# EAGLE design main (EAGLE 6.5.0)
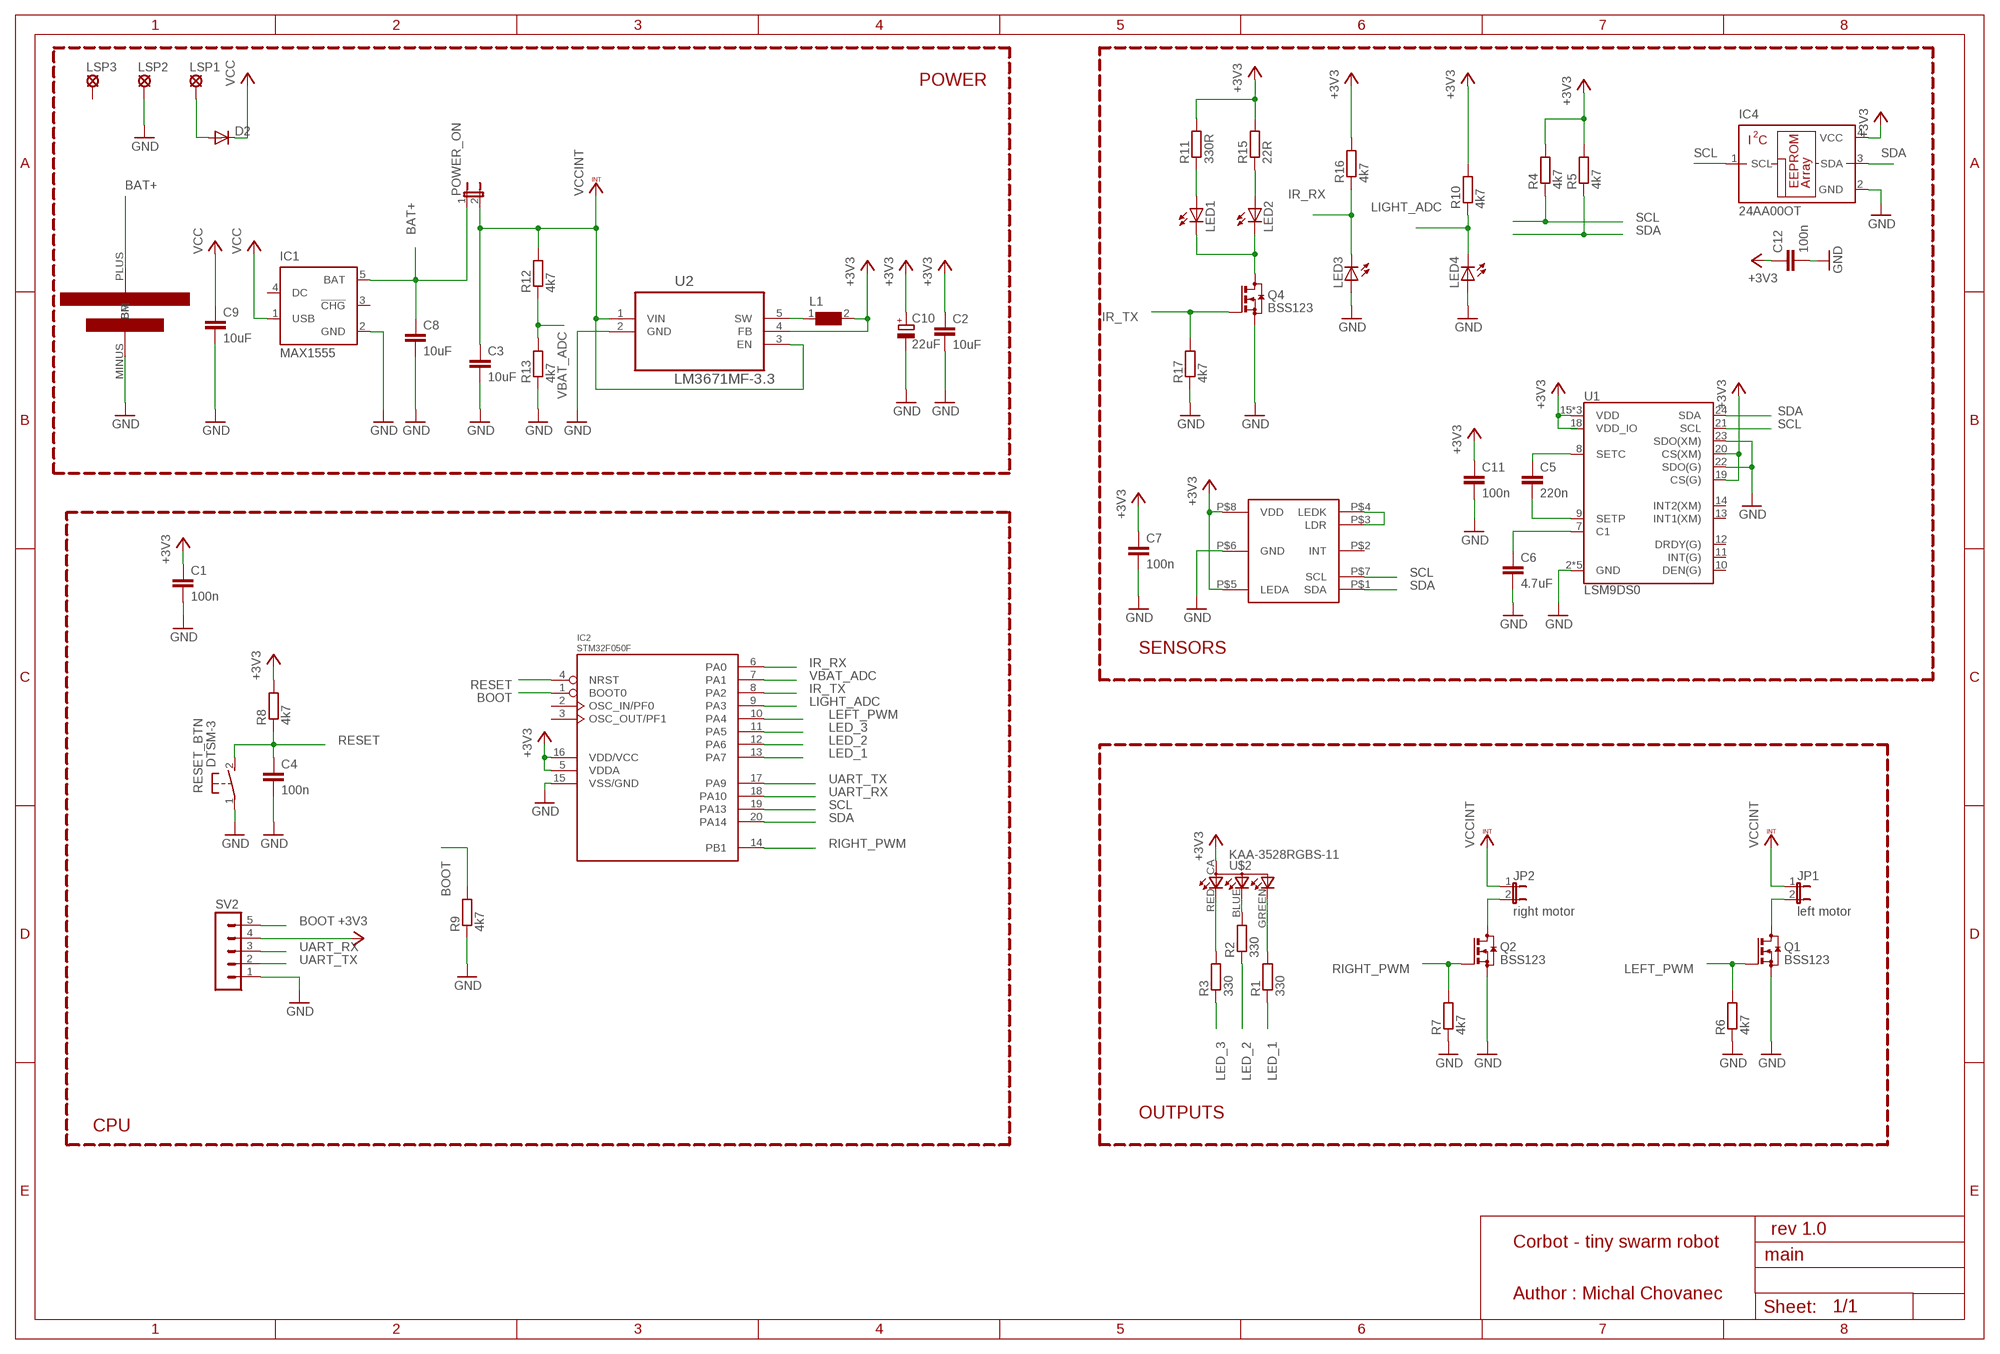
[diagram p0: schematic, sheet 1]

## Parts
C1  100n  C-EUC0805  [C0805]
C2  10uF  C-EUC0805  [C0805]
C3  10uF  C-EUC0805  [C0805]
C4  100n  C-EUC0805  [C0805]
C5  220n  C-EUC0805  [C0805]
C6  4.7uF  C-EUC0805  [C0805]
C7  100n  C-EUC0805  [C0805]
C8  10uF  C-EUC0805  [C0805]
C9  10uF  C-EUC0805  [C0805]
C10  22uF  CPOL-EU153CLV-0505  [153CLV-0505]
C11  100n  C-EUC0805  [C0805]
C12  100n  C-EUC0805  [C0805]
D2  DIODE-DO-214AC  [DO-214AC]
IC1  MAX1555  [SOT23-5L]
IC2  STM32F050F  [TSSOP20]
IC4  24AA00OT  [SOT23-5L]
JP1  left motor  JP1E  [JP1]
JP2  right motor  JP1E  [JP1]
L1  WE-LQ-744032002_M  [WE-LQ_M]
LED1  LEDCHIPLED_1206  [CHIPLED_1206]
LED2  LEDCHIPLED_1206  [CHIPLED_1206]
LED3  LEDCHIPLED_1206  [CHIPLED_1206]
LED4  LEDCHIPLED_1206  [CHIPLED_1206]
LSP1  LSP13  [LSP13]
LSP2  LSP13  [LSP13]
LSP3  LSP13  [LSP13]
POWER_ON  JP1E  [JP1]
Q1  BSS123  [SOT23]
Q2  BSS123  [SOT23]
Q4  BSS123  [SOT23]
R1  330  R-EU_M0805  [M0805]
R2  330  R-EU_M0805  [M0805]
R3  330  R-EU_M0805  [M0805]
R4  4k7  R-EU_M0805  [M0805]
R5  4k7  R-EU_M0805  [M0805]
R6  4k7  R-EU_M0805  [M0805]
R7  4k7  R-EU_M0805  [M0805]
R8  4k7  R-EU_M0805  [M0805]
R9  4k7  R-EU_M0805  [M0805]
R10  4k7  R-EU_M0805  [M0805]
R11  330R  R-EU_M0805  [M0805]
R12  4k7  R-EU_M0805  [M0805]
R13  4k7  R-EU_M0805  [M0805]
R15  22R  R-EU_M0805  [M0805]
R16  4k7  R-EU_M0805  [M0805]
R17  4k7  R-EU_M0805  [M0805]
RESET_BTN  DTSM-3  [DTSM-3]
SV2  MA05-1  [MA05-1]
U1  LSM9DS0  [LGA-24]
U2  LM3671MF-3.3  [SOT95P284X122-5N]
U$1  SMTU_2450N  [SMTU_2450N]
U$2  KAA-3528RGBS-11  [LED-RGB]
U$3  APDS9950  [APDS9950]

## Nets
+3V3: C1.1 C2.1 C7.1 C10.+ C11.1 C12.1 IC2.5(VDDA) IC2.16(VDD/VCC) IC4.4(VCC) L1.2 R4.2 R5.2 R8.2 R10.2 R11.2 R15.2 R16.2 SV2.4 U1.15(VDD) U1.16(VDD) U1.17(VDD) U1.19(CS(G)) U1.20(CS(XM)) U2.4(FB) U$2.CA(A) U$3.P$5(LEDA) U$3.P$8(VDD)
BAT+: C8.1 IC1.5(BAT) POWER_ON.1 U$1.PLUS(BP)
BOOT: IC2.1(BOOT0) R9.2 SV2.5
GND: C1.2 C2.2 C3.2 C4.2 C6.2 C7.2 C8.2 C9.2 C10.- C11.2 C12.2 IC1.2(GND) IC2.15(VSS/GND) IC4.2(GND) LED3.A LED4.A LSP2.MP Q1.2(S) Q2.2(S) Q4.2(S) R6.1 R7.1 R9.1 R13.1 R17.1 RESET_BTN.1 SV2.1 U1.2(GND) U1.3(GND) U1.4(GND) U1.5(GND) U1.6(GND) U1.22(SDO(G)) U1.23(SDO(XM)) U2.2(GND) U$1.MINUS(BM) U$3.P$6(GND)
IR_RX: IC2.6(PA0) LED3.C R16.1
IR_TX: IC2.8(PA2) Q4.1(G) R17.2
LED_1: IC2.13(PA7) R1.1
LED_2: IC2.12(PA6) R2.1
LED_3: IC2.11(PA5) R3.1
LEFT_PWM: IC2.10(PA4) Q1.1(G) R6.2
LIGHT_ADC: IC2.9(PA3) LED4.C R10.1
N$1: R3.2 U$2.RED(CRED)
N$2: R2.2 U$2.BLUE(CBLUE)
N$3: R1.2 U$2.GREEN(CGREEN)
N$4: U$3.P$3(LDR) U$3.P$4(LEDK)
N$5: C6.1 U1.7(C1)
N$6: LED1.C LED2.C Q4.3(D)
N$7: L1.1 U2.5(SW)
N$8: C5.1 U1.8(SETC)
N$9: D2.A LSP1.MP
N$10: LED2.A R15.1
N$11: C5.2 U1.9(SETP)
N$14: JP1.2 Q1.3(D)
N$15: JP2.2 Q2.3(D)
N$16: LED1.A R11.1
RESET: C4.1 IC2.4(NRST) R8.1 RESET_BTN.2
RIGHT_PWM: IC2.14(PB1) Q2.1(G) R7.2
SCL: IC2.19(PA13) IC4.1(SCL) R4.1 U1.21(SCL) U$3.P$7(SCL)
SDA: IC2.20(PA14) IC4.3(SDA) R5.1 U1.24(SDA) U$3.P$1(SDA)
UART_RX: IC2.18(PA10) SV2.3
UART_TX: IC2.17(PA9) SV2.2
VBAT_ADC: IC2.7(PA1) R12.1 R13.2
VCC: C9.1 D2.C IC1.1(USB)
VCCINT: C3.1 JP1.1 JP2.1 POWER_ON.2 R12.2 U2.1(VIN) U2.3(EN)
Unconnected: IC1.3(!CHG) IC1.4(DC) IC2.2(OSC_IN/PF0) IC2.3(OSC_OUT/PF1) LSP3.MP U1.10(DEN(G)) U1.11(INT(G)) U1.12(DRDY(G)) U1.13(INT1(XM)) U1.14(INT2(XM)) U1.18(VDD_IO) U$3.P$2(INT)

## Notes on the sheet
- POWER
- SENSORS
- OUTPUTS
- CPU
- rev 1.0
- Corbot - tiny swarm robot
- Author : Michal Chovanec

## Library data of the parts
C1-C9 C11 C12 = resistor:C-EU: CAPACITOR, European symbol
C10 = resistor:CPOL-EU: POLARIZED CAPACITOR, European symbol
D2 = diode:DIODE-: DIODE
IC1 = maxim:MAX1555: Dual-Input USB/AC Adapter 1-Cell Li+ Battery Chargers Source: http://www.maxim-ic.com .. MAX1551-MAX1555.pdf; MF: MAXIM; MPN: MAX1555EZK+T; OC_FARNELL: 1628222; OC_NEWARK: 59J2761
IC2 = STM32F050:STM32F050*: STM32F050xxF*
IC4 = microchip:24*00: Serial EEPROM 128 bit, I2C (AA = 1.8 V/LC = 2.5 V/C = 5.0 V); MF: MICROCHIP; MPN: 24AA00T-I/OTG; OC_FARNELL: 1331264; OC_NEWARK: 89H3038
JP1 JP2 POWER_ON = jumper:JP1E: JUMPER
L1 = WE-LQ:WE-LQ: SMD RF Inductor WE-LQ - High Q at high frequences - Low DC-resistance - Miniature chip inductor wound on a special ferrite core -- Low power DC/DC-converters from Linear Technology, National Semiconductor, Texas Instruments and Fairchild Semiconductor ect. -- Test & measurement equipment -- EMI-Filtering -- RF-circuit; MPN: 744032002; OC_FARNELL: 1800378; OC_NEWARK: 78R5670; PACKAGE: 1210; SUPPLIER: WURTH ELEKTRONIK
LED1-LED4 = led:LED: LED OSRAM: - CHIPLED LG R971, LG N971, LY N971, LG Q971, LY Q971, LO R971, LY R971 LH N974, LH R974 LS Q976, LO Q976, LY Q976 LO Q996 - Hyper CHIPLED LW Q18S LB Q993, LB Q99A, LB R99A - SideLED LS A670, LO A670, LY A670, LG A670, LP A670 LB A673, LV A673, LT A673, LW A673 LH A674 LY A675 LS A676, LA A676, LO A676, LY A676, LW A676 LS A679, LY A679, LG A679 - Hyper Micro SIDELED® LS Y876, LA Y876, LO Y876, LY Y876 LT Y87S - SmartLED LW L88C, LW L88S LB L89C, LB L89S, LG L890 LS L89K, LO L89K, LY L89K LS L896, LA L896, LO L896, LY L896 - TOPLED LS T670, LO T670, LY T670, LG T670, LP T670 LSG T670, LSP T670, LSY T670, LOP T670, LYG T670 LG T671, LOG T671, LSG T671 LB T673, LV T673, LT T673, LW T673 LH T674 LS T676, LA T676, LO T676, LY T676, LB T676, LH T676, LSB T676, LW T676 LB T67C, LV T67C, LT T67C, LS T67K, LO T67K, LY T67K, LW E67C LS E67B, LA E67B, LO E67B, LY E67B, LB E67C, LV E67C, LT E67C LW T67C LS T679, LY T679, LG T679 LS T770, LO T770, LY T770, LG T770, LP T770 LB T773, LV T773, LT T773, LW T773 LH T774 LS E675, LA E675, LY E675, LS T675 LS T776, LA T776, LO T776, LY T776, LB T776 LHGB T686 LT T68C, LB T68C - Hyper Mini TOPLED® LB M676 - Mini TOPLED Santana® LG M470 LS M47K, LO M47K, LY M47K Source: http://www.osram.convergy.de LUXEON: - LUMILED® LXK2-PW12-R00, LXK2-PW12-S00, LXK2-PW14-U00, LXK2-PW14-V00 LXK2-PM12-R00, LXK2-PM12-S00, LXK2-PM14-U00 LXK2-PE12-Q00, LXK2-PE12-R00, LXK2-PE12-S00, LXK2-PE14-T00, LXK2-PE14-U00 LXK2-PB12-K00, LXK2-PB12-L00, LXK2-PB12-M00, LXK2-PB14-N00, LXK2-PB14-P00, LXK2-PB14-Q00 LXK2-PR12-L00, LXK2-PR12-M00, LXK2-PR14-Q00, LXK2-PR14-R00 LXK2-PD12-Q00, LXK2-PD12-R00, LXK2-PD12-S00 LXK2-PH12-R00, LXK2-PH12-S00 LXK2-PL12-P00, LXK2-PL12-Q00, LXK2-PL12-R00 Source: www.luxeon.com KINGBRIGHT: KA-3528ASYC Source: www.kingbright.com
LSP1-LSP3 = solpad:LSP13: SOLDER PAD drill 1.3 mm, distributor Buerklin, 12H562
Q1 Q2 Q4 = transistor-small-signal:BSS123: N-CHANNEL MOS FET
R1-R13 R15-R17 = resistor:R-EU_: RESISTOR, European symbol
RESET_BTN = switch-tact:DTSM-3
SV2 = con-lstb:MA05-1: PIN HEADER; OC_FARNELL: unknown; OC_NEWARK: unknown
U1 = main:LSM9DS0: LSM9DS0 3D Accelerometer, 3D Gyroscope, 3D Magnetomter Features: 3 acceleration channels, 3 angular rate channels, 3 magnetic field channels ±2/±4/±6/±8/±16 g linear acceleration full scale ±2/±4/±8/±12 gauss magnetic full scale ±245/±500/±2000 dps angular rate full scale 16-bit data output SPI / I2C serial interfaces Analog supply voltage 2.4 V to 3.6 V Power-down mode / low-power mode Programmable interrupt generators Embedded self-test Embedded temperature sensor Embedded FIFO Position and motion detection functions Click/double-click recognition
U2 = my_parts:LM3671MF-3.3: IC BUCK SYNC 3.3V 0.6A; MPN: LM3671MF-3.3; OC_FARNELL: 1685767; OC_NEWARK: 79K7838; PACKAGE: 5-SOT-23; SUPPLIER: NationalSemiconductor
U$1 = corbot:SMTU_2450N
U$2 = corbot:KAA-3528RGBS-11: Farnell ID : 2335789
U$3 = main:APDS9950

## Board
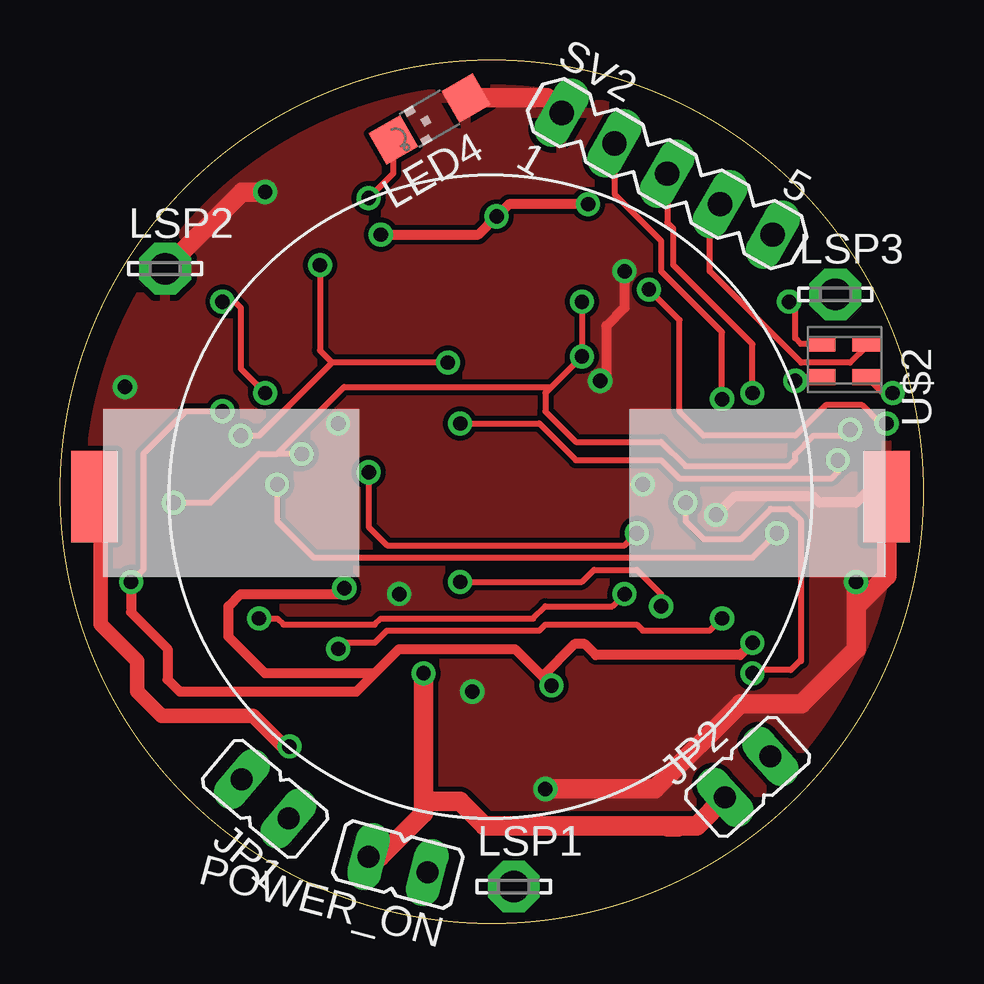
[diagram p1: board, top side]
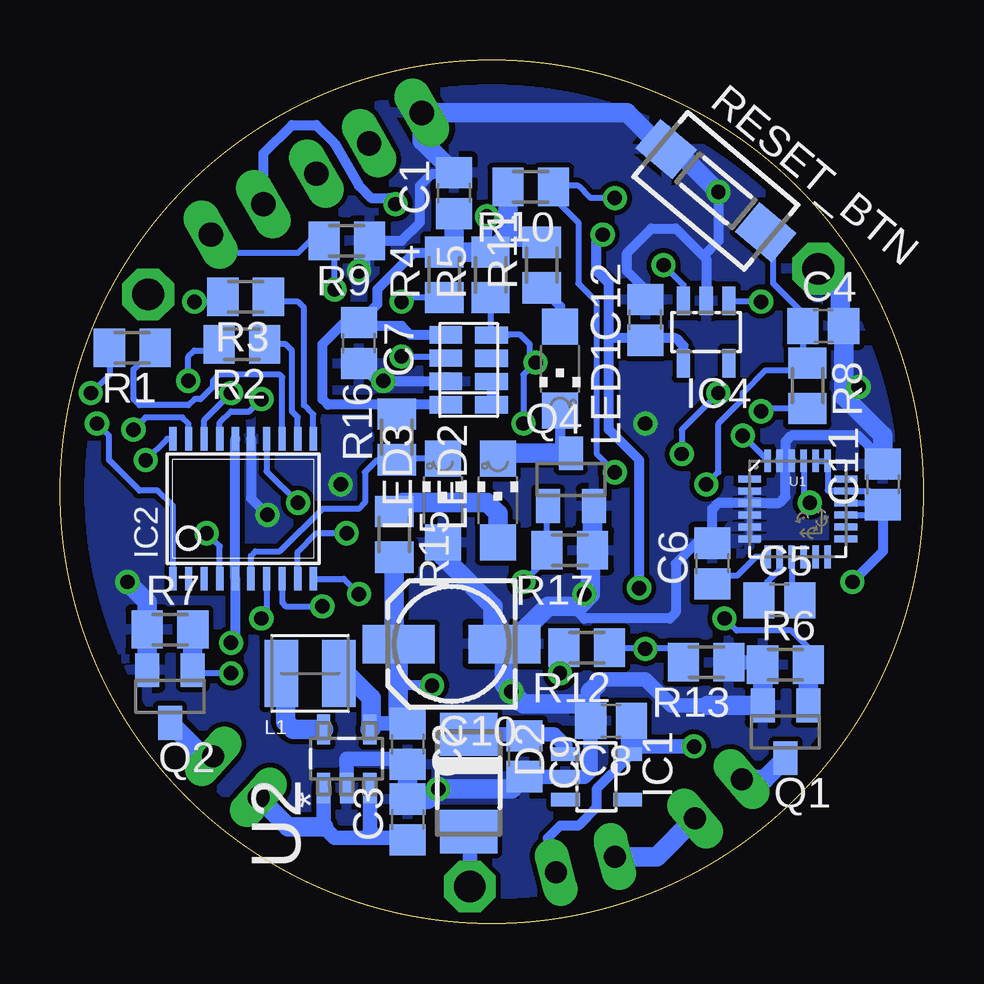
[diagram p2: board, bottom side, seen from below]

Size 36 x 36 mm. Coordinates in mm from the lower left corner, seen from the top.
Outline: circle at 18,18 radius 18
Copper layers (1*16): Top 0.035mm / dielectric 1.5mm / Bottom 0.035mm
Design rules "default": minimum track width 10mil, minimum drill 24mil, track to track 8mil, track to pad 8mil, pad to pad 8mil, via to via 8mil, smd to smd 8mil, copper to edge 40mil, drill to drill 8mil, minimum pad ring 10mil, minimum via ring 8mil, stop-mask expansion 4mil, vias tented up to drill 0mil, thermal gap 10mil

### Footprints (pad centres in the part's own frame; a part is rotated, then mirrored left to right if it is on the bottom)
C0805 = smd 1.3 x 1.5: 1 -0.85,0; 2 0.85,0
153CLV-0505 = smd 3 x 1.6: + 2.2,0; - -2.2,0
DO-214AC = smd 1.8 x 2.4: A 2.025,0; C -2.025,0
SOT23-5L = smd 0.55 x 1.2: 1 -0.95,-1.3; 2 0,-1.3; 3 0.95,-1.3; 4 0.95,1.3; 5 -0.95,1.3
TSSOP20 = smd 0.305 x 0.991: 1 -2.925,-2.918; 2 -2.275,-2.918; 3 -1.625,-2.918; 4 -0.975,-2.918; 5 -0.325,-2.918; 6 0.325,-2.918; 7 0.975,-2.918; 8 1.625,-2.918; 9 2.275,-2.918; 10 2.925,-2.918; 11 2.925,2.918; 12 2.275,2.918; 13 1.625,2.918; 14 0.975,2.918; 15 0.325,2.918; 16 -0.325,2.918; 17 -0.975,2.918; 18 -1.625,2.918; 19 -2.275,2.918; 20 -2.925,2.918
JP1 = drill 0.914 long: 1 0,-1.27; 2 0,1.27
WE-LQ_M = smd 1.4 x 2.8: 1 -1.2,0; 2 1.2,0
CHIPLED_1206 = smd 1.5 x 1.5: A 0,-1.75; C 0,1.75
LSP13 = drill 1.321 pad 2.159 octagon: MP 0,0
SOT23 = smd 1 x 1.4: 1 -0.95,-1.1; 2 0.95,-1.1; 3 0,1.1
M0805 = smd 1.3 x 1.6: 1 -0.95,0; 2 0.95,0
DTSM-3 = smd 2 x 1.6: 1 -2.7,0; 2 2.7,0
MA05-1 = drill 1.016 long: 1 -5.08,0; 2 -2.54,0; 3 0,0; 4 2.54,0; 5 5.08,0
LGA-24 = smd 0.954 x 0.29: 1 -2.002,1.25; 2 -2.002,0.75; 3 -2.002,0.25; 4 -2.002,-0.25; 5 -2.002,-0.75; 6 -2.002,-1.25; 13 2.002,-1.25; 14 2.002,-0.75; 15 2.002,-0.25; 16 2.002,0.25; 17 2.002,0.75; 18 2.002,1.25 | smd 0.29 x 0.954: 7 -1.25,-2.002; 8 -0.75,-2.002; 9 -0.25,-2.002; 10 0.25,-2.002; 11 0.75,-2.002; 12 1.25,-2.002; 19 1.25,2.002; 20 0.75,2.002; 21 0.25,2.002; 22 -0.25,2.002; 23 -0.75,2.002; 24 -1.25,2.002
SOT95P284X122-5N = smd 1.27 x 0.559: 1 -1.219,0.965; 2 -1.219,0; 3 -1.219,-0.965; 4 1.219,-0.965; 5 1.219,0.965
SMTU_2450N = smd 1.93 x 3.81: MINUS 16.51,0; PLUS -16.51,0
LED-RGB = smd 0.65 x 1.2: BLUE 2.634,0.827; CA 1.252,2.729; GREEN 2.634,2.729; RED 1.252,0.827
APDS9950 = smd 1.362 x 0.72: P$1 0.954,1.4; P$2 0.954,0.43; P$3 0.954,-0.54; P$4 0.954,-1.51; P$5 -0.954,-1.5; P$6 -0.954,-0.53; P$7 -0.954,0.44; P$8 -0.954,1.41

### Placement (x,y rotation side)
C1  19.57,30.45 90 bottom
C2  21.51,7.48 270 bottom
C3  21.51,4.33 90 bottom
C4  4.18,24.91 0 bottom
C5  6.01,13.48 0 bottom
C6  8.81,15 90 bottom
C7  23.54,24.2 270 bottom
C8  13.02,8.45 180 bottom
C9  16.63,6.98 270 bottom
C10  19.68,11.65 180 bottom
C11  1.69,18.3 90 bottom
C12  11.6,25.16 90 bottom
D2  18.97,5.86 270 bottom
IC1  13.63,6.11 270 bottom
IC2  28.36,17.29 0 bottom
IC4  9.06,24.65 180 bottom
JP1  8.55,5.2 50 top
JP2  28.67,6.11 312 top
L1  25.57,10.43 0 bottom
LED1  15.16,23.13 180 bottom
LED2  17.75,17.64 0 bottom
LED3  20.03,17.64 0 bottom
LED4  15.41,33.54 120 top
LSP1  18.91,1.54 0 top
LSP2  4.39,27.3 0 top
LSP3  32.33,26.23 0 top
POWER_ON  14.09,2.46 75 top
Q1  5.76,7.99 180 bottom
Q2  31.41,9.47 180 bottom
Q4  14.7,18.51 0 bottom
R1  32.99,23.99 180 bottom
R2  28.41,24.15 180 bottom
R3  28.26,26.13 180 bottom
R4  19.98,27.04 90 bottom
R5  18.05,27.04 90 bottom
R6  5.76,10.79 0 bottom
R7  31.41,12.26 0 bottom
R8  4.84,22.42 270 bottom
R9  24.05,28.46 180 bottom
R10  16.37,30.7 180 bottom
R11  15.92,27.45 90 bottom
R12  14.04,11.5 180 bottom
R13  9.06,10.89 180 bottom
R15  22.06,16.22 270 bottom
R16  21.96,20.29 90 bottom
R17  14.75,15.56 180 bottom
RESET_BTN  8.65,30.55 320 bottom
SV2  25.32,31.26 330 top
U1  5.25,17.29 0 bottom
U2  24.05,6.87 90 bottom
U$1  17.95,17.8 0 top
U$2  30.9,25.42 270 top
U$3  18.97,23.13 0 bottom

### Tracks (layer width: path | path; a pad name or v marks a point on that pad's centre or on a via)
+3V3  (via drill 0.6)
  Top 0.254: v6.77,21.35 5.25,21.35 3.47,19.57 3.47,14.75 v2.96,14.24 | U$2.CA 33.63,24.08 32.94,23.38 30.9,23.38 27.09,27.19 27.09,29.57 SV2.4
  Top 0.406: v2.96,14.24 2.96,12.97 4.49,11.45 4.49,10.18 5,9.67 12.36,9.67 13.12,10.43 | 20.11,10.3 18.97,11.45 14.14,11.45 13.12,10.43 | 20.11,10.3 v20.49,9.92 | v28.87,11.7 28.36,11.19 22.33,11.19 C10.+ 21.45,11.65 20.11,10.3 | v22.01,29.99 18.71,29.99 v18.2,29.48 17.44,28.72 v13.38,28.72 | 13.12,10.43 8.55,10.43 7.03,11.95 7.03,13.22 7.54,13.73 11.6,13.73 v11.85,13.99
  Bottom 0.254: 21.9,11.63 21.89,11.63 C10.+ | U1.16 1.78,17.54 C11.1 | C11.1 2.28,18.04 U1.17 3.26,18.05 3.98,18.05 4,18.07 U1.19 U1.20 | U1.15 2.11,17.04 C11.1 | R8.2 6.66,21.47 v6.77,21.35
  Bottom 0.406: C11.1 1.69,15.51 v2.96,14.24 | v20.49,9.92 21.64,9.92 21.9,10.18 | U$3.P$5 21.57,21.63 R16.2 | 15.85,28.46 R11.2 17.64,28.4 R5.2 18.2,28.14 v18.2,29.48 | 19.98,21.57 U$3.P$5 | U$3.P$5 24.83,21.63 25.06,21.86 25.06,24.15 24.16,25.05 C7.1 | 20.24,27.96 19.98,27.96 | R4.2 20.2,27.99 20.24,27.96 | v28.87,11.7 28.69,11.88 IC2.5 IC2.16 | U$3.P$8 21.39,24.54 21.76,24.91 23.4,24.91 C7.1 | 20.24,27.96 21.25,27.96 22.78,26.43 22.78,25.81 C7.1 | SV2.4 27.52,32.11 26.33,33.29 25.32,33.29 24.55,32.53 23.54,30.75 23.03,30.24 22.27,30.24 v22.01,29.99 | v11.85,13.99 11.85,19.32 13.12,20.59 13.12,24.4 | v13.38,28.72 13.63,28.46 13.63,27.19 13.12,26.69 13.12,24.4 | IC4.4 10.01,24.08 10.33,24.4 11.51,24.4 | 11.51,24.4 C12.1 | 11.51,24.4 13.12,24.4
  Bottom 0.61: 22.85,8.33 U2.4 22.84,8.33 C2.1
  Bottom 0.813: 21.9,11.63 21.9,10.18 21.9,8.72 C2.1 | L1.2 24.05,10.43 23.03,9.41 23.03,8.14 U2.4 | R15.2 22.06,11.84 C10.+ | R10.2 17.32,28.72 R5.2 19.47,27.99 | 19.47,27.99 R4.2 | C1.1 19.58,28.09 19.47,27.99
BAT+  (via drill 0.6)
  Top 0.61: v9.57,7.38 9.31,7.38 8.04,8.65 4.23,8.65 3.22,9.67 3.22,10.94 1.69,12.46 1.69,17.54 U$1.PLUS
  Bottom 0.406: IC1.5 12.33,6.9 13.63,5.6 13.63,4.84 14.39,4.08 15.16,4.08 15.66,3.57 15.66,2.47 POWER_ON.1
  Bottom 0.61: C8.1 12.33,8.29 IC1.5 12.01,7.38 v9.57,7.38
BOOT  (via drill 0.6)
  Top 0.254: v34.46,20.84 34.21,20.84 33.44,21.61 31.92,21.61 30.65,20.34 26.84,20.34 25.82,21.35 25.82,25.16 v24.55,26.43
  Bottom 0.254: SV2.5 28.95,27.96 26.08,27.96 25.13,28.91 R9.2 24.55,28.02 v24.55,26.43 | IC2.1 31.29,17.42 31.92,18.05 32.68,18.05 33.95,19.32 33.95,20.34 v34.46,20.84
GND  (via drill 0.6)
  Top 0.406: U$1.MINUS 34.21,18.05 33.7,18.05 33.19,17.54 31.67,17.54 31.41,17.8 28.11,17.8 v27.35,17.03 | v23.54,27.19 23.54,25.67 22.78,24.91 22.78,22.88 v22.52,22.62
  Top 0.813: v33.19,14.24 33.19,13.22 | 33.19,13.22 33.19,11.45 30.9,9.16 28.36,9.16 24.81,5.6 v20.24,5.6 | v8.55,30.5 7.59,30.5 LSP2.MP | LED4.A 20.3,34.42 SV2.1 | U$1.MINUS 34.46,14.49 33.19,13.22
  Bottom 0.254: U1.2 U1.3 U1.4 U1.5 U1.6 | 5.76,19.05 5.74,19.05 U1.22
  Bottom 0.406: U1.23 5.76,19.05 5.76,17.8 6.02,17.54 U1.3 | U1.3 8.55,17.54 8.81,17.29 C6.2 9.48,15.85 10.33,15 10.33,12.97 10.58,12.72 14.14,12.72 14.65,13.22 | 6.77,17.54 U1.3 | C11.2 1.69,19.32 2.71,20.34 5.5,20.34 5.76,20.08 5.76,19.55 U1.22 | C1.2 19.61,31.26 20.49,31.26 21,30.75 21,29.23 21.76,28.46 R9.1 23.28,28.28 23.28,27.19 v23.54,27.19 | C7.2 22.81,22.62 v22.52,22.62 22.25,22.6 U$3.P$6 | IC2.15 28.04,17.73 v27.35,17.03 | C12.2 11.6,26.43 12.36,27.19 12.36,27.96 11.35,28.97 10.33,28.97 9.19,27.83 | 9.19,27.83 9.06,27.7 IC4.2 | v8.55,30.5 8.55,28.46 9.19,27.83
  Bottom 0.61: 21.75,6.87 24.05,6.87 U2.2 | C8.2 13.89,6.37 14.14,6.11 IC1.2 16.62,6.11 C9.2 | 8.99,9.09 10.52,9.09 11.6,10.18 13.38,10.18 13.63,9.92 | R13.1 6.81,10.89 R6.1
  Bottom 0.813: R6.1 Q1.2 8.99,9.09 | 13.63,9.92 13.89,9.67 13.89,9.16 | 13.89,9.16 13.89,8.46 C8.2 | Q2.2 R7.1 32.36,13.41 v33.19,14.24 | C9.2 17.15,5.6 v20.24,5.6 20.66,5.18 C3.2 C2.2 21.75,6.87 | C10.- 17.48,9.96 16.68,9.16 13.89,9.16 | C10.- 17.24,11.65 15.66,13.22 14.65,13.22 14.39,13.22 13.89,13.73 13.89,15.47 R17.1 13.8,17.36 Q4.2 | LED3.A 20.03,15.31 17.95,13.22 17.95,12.12 C10.- | LSP2.MP 4.08,27.3 3.47,26.69 3.47,25.05 C4.2 3.33,21.98 1.69,20.34 C11.2 | v8.55,30.5 10.34,32.28 RESET_BTN.1 10.85,32.28 12.36,33.8 SV2.1 | SV2.1 20.92,32.64 C1.2 | SV2.1
  other vias: 11.6,20.84 14.14,13.73 17.19,9.67 2.71,22.37 24.3,18.3
  pour Bottom: -5.93,43.96 37.51,43.96 37.51,-5.06 -5.93,-5.06
  pour Top: -8.21,37.1 38.78,37.1 38.78,-3.79 -8.21,-3.79
IR_RX
  Bottom 0.254: LED3.C 21.9,19.39 R16.1 21.98,19.32 22.78,19.32 23.28,18.81 23.28,17.54 23.54,17.29 25.06,17.29 26.84,15.51 27.86,15.51 28.04,15.33 IC2.6
IR_TX  (via drill 0.6)
  Top 0.254: v16.68,14.24 21.76,14.24 22.27,14.75 24.05,14.75 25.06,13.73 v25.06,13.22
  Bottom 0.254: Q4.1 15.7,17.36 R17.2 15.7,15.22 v16.68,14.24 | IC2.8 26.74,13.38 26.59,13.22 v25.06,13.22
LED_1
  Bottom 0.254: R1.1 32.94,23.09 32.94,21.86 32.68,21.61 30.65,21.61 30.4,21.86 30.14,21.86 29.63,22.37 29.63,22.62 29.38,22.88 26.84,22.88 26.74,22.78 IC2.13
LED_2
  Bottom 0.254: IC2.12 26.09,21.11 26.33,21.35 26.33,23.89 26.59,24.15 R2.1
LED_3
  Bottom 0.254: IC2.11 25.44,21.22 25.82,21.61 25.82,25.67 26.08,25.92 27.11,25.92 R3.1
LEFT_PWM  (via drill 0.6)
  Top 0.254: v8.3,12.72 9.06,12.72 9.31,12.46 13.12,12.46 13.38,12.72 19.73,12.72 20.24,13.22 23.03,13.22 v23.54,13.73
  Bottom 0.254: R6.2 4.81,11.51 5.5,12.21 7.79,12.21 v8.3,12.72 | IC2.10 24.18,14.37 v23.54,13.73
  Bottom 0.813: Q1.1 R6.2
LIGHT_ADC  (via drill 0.6)
  Top 0.254: LED4.C 13.89,31.27 v12.87,30.24 | v12.87,18.81 12.87,16.53 13.63,15.76 23.54,15.76 v24.05,16.27
  Bottom 0.254: v12.87,30.24 13.89,30.24 14.39,30.75 15.37,30.75 R10.1 15.42,30.26 14.39,29.23 14.39,26.69 13.63,25.92 13.63,19.57 v12.87,18.81 | IC2.9 26.09,15.5 25.32,16.27 v24.05,16.27
N$1  (via drill 0.6)
  Top 0.254: U$2.RED 30.89,24.16 30.65,24.4 30.65,25.67 v30.4,25.92
  Bottom 0.254: v30.4,25.92 29.42,25.92 R3.2
N$2  (via drill 0.6)
  Top 0.254: U$2.BLUE 30.74,22.78 v30.65,22.62
  Bottom 0.254: v30.65,22.62 30.65,23.64 30.4,23.89 29.62,23.89 R2.2
N$3  (via drill 0.6)
  Top 0.254: v34.71,22.11 34.3,22.11 U$2.GREEN
  Bottom 0.254: R1.2 33.94,22.89 v34.71,22.11
N$4
  Bottom 0.406: U$3.P$3 U$3.P$4
N$5
  Bottom 0.254: U1.7 7,15.29 7.79,14.49 8.46,14.49 C6.1
N$6
  Bottom 0.406: LED1.C 15.16,19.86 15.41,19.61
  Bottom 0.813: Q4.3 15.41,19.61 17.53,19.61 LED2.C
N$7
  Bottom 0.813: U2.5 26.28,8.09 26.59,8.4 26.59,10.25 L1.1
N$8
  Bottom 0.254: U1.8 6,14.76 6.52,14.24 6.52,13.82 C5.1
N$9
  Bottom 0.61: LSP1.MP 18.91,3.78 D2.A
N$10
  Bottom 0.813: LED2.A 17.75,17.09 18.2,17.54 21.69,17.54 R15.1
N$11
  Bottom 0.254: U1.9 5.5,13.82 C5.2
N$14
  Bottom 0.813: JP1.2 6.64,6.01 Q1.3
N$15
  Bottom 0.813: JP2.2 30.01,6.96 Q2.3
N$16
  Bottom 0.406: LED1.A 15.16,25.74 R11.1
RESET  (via drill 0.6)
  Top 0.254: v9.06,18.3 9.06,16.78 10.58,15.26 28.87,15.26 v29.89,16.27
  Bottom 0.254: v9.06,18.3 8.55,18.81 8.55,20.84 7.54,21.86 7.54,22.11 6.58,23.07 5.4,23.07 R8.1 5.03,23.43 C4.1 5.03,25.45 6.27,26.69 6.27,28.49 RESET_BTN.2 | IC2.4 29.34,15.72 v29.89,16.27
RIGHT_PWM  (via drill 0.6)
  Top 0.254: v28.87,10.43 29.01,10.57 Q2.1 30.83,10.94 30.9,10.94 30.9,16.78 30.4,17.29 29.63,17.29 28.36,16.02 26.84,16.02 26.08,16.78 v26.08,17.54
  Bottom 0.254: R7.2 30.46,11.51 | v28.87,10.43 30.33,10.43 Q2.1 | IC2.14 27.39,18.85 v26.08,17.54
  Bottom 0.813: R7.2 Q2.1
SCL  (via drill 0.6)
  Top 0.254: v4.74,17.54 6.27,17.54 8.3,19.57 9.06,19.57 | 9.06,19.57 11.85,22.37 20.49,22.37 v21.76,23.64 | v21.76,25.92 v21.76,23.64 | v21.76,23.64 20.24,22.11 20.24,21.35 21.51,20.08 25.06,20.08 26.08,19.07 30.4,19.07 30.65,19.32 30.65,19.57 31.41,20.34 32.68,20.34 v32.94,20.59 | v10.08,19.57 9.06,19.57 | v6.77,25.92 7.28,25.92 7.54,25.67 7.54,23.13 v8.55,22.11
  Bottom 0.254: U1.21 5,17.8 v4.74,17.54 | v21.76,23.64 19.99,23.64 U$3.P$7 | R4.1 21.59,26.09 v21.76,25.92 | IC2.19 30.64,20.83 30.9,21.1 32.43,21.1 v32.94,20.59 | IC4.1 6.8,25.95 v6.77,25.92 | v8.55,22.11 10.08,20.59 v10.08,19.57
SDA  (via drill 0.6)
  Top 0.254: v7.54,20.34 8.3,20.34 11.35,23.38 | v16.17,23.38 11.35,23.38 | v16.68,20.84 19.98,20.84 21.51,19.32 25.06,19.32 25.82,18.56 32.17,18.56 32.43,18.81 v32.43,19.32 | v10.84,27.45 10.84,23.89 11.35,23.38
  Bottom 0.254: U1.24 6.5,19.3 v7.54,20.34 | 17.32,24.53 U$3.P$1 18.05,24.57 | R5.1 18.05,24.57 | v16.68,20.84 16.68,22.88 v16.17,23.38 16.43,23.64 16.43,24.15 16.85,24.57 18.05,24.57 | IC2.20 31.54,20.21 v32.43,19.32 | IC4.3 10.01,26.62 v10.84,27.45
UART_RX  (via drill 0.6)
  Top 0.254: SV2.3 25.32,29.23 25.57,28.97 25.57,27.45 28.87,24.15 v28.87,22.11
  Bottom 0.254: IC2.18 29.99,21 v28.87,22.11
UART_TX  (via drill 0.6)
  Top 0.254: SV2.2 23.12,30.41 25.06,28.46 25.06,27.19 27.6,24.65 v27.6,21.86
  Bottom 0.254: IC2.17 29.34,20.89 28.87,21.35 28.11,21.35 v27.6,21.86
VBAT_ADC  (via drill 0.6)
  Top 0.254: v27.6,12.72 27.09,12.21 24.3,12.21 24.05,12.46 20.24,12.46 19.98,12.21 13.63,12.21 13.12,11.7 11.85,11.7 v11.6,11.45
  Bottom 0.254: R13.2 10.11,11.5 R12.1 11.8,11.5 v11.6,11.45 | IC2.7 27.39,12.93 v27.6,12.72
VCC
  Bottom 0.61: IC1.1 14.93,7.41 15.41,7.89 15.92,7.89 | 15.92,7.89 16.56,7.89 C9.1 | D2.C 15.92,7.88 15.92,7.89
VCCINT  (via drill 0.6)
  Top 0.813: POWER_ON.2 13.35,2.78 15.16,4.59 15.16,5.1 | 25.32,4.08 25.82,4.08 | 25.82,4.08 26.54,4.08 JP2.1 | v15.16,10.43 15.16,5.1 | 25.82,4.08 25.77,4.03 25.32,4.03 25.26,4.08 17.7,4.08 16.68,5.1 15.16,5.1
  Bottom 0.61: U2.3 23.08,3.88 22.78,3.57 | 22.78,3.57 21.59,3.57 C3.1 | U2.1 25.01,4.03 24.55,3.57 22.78,3.57
  Bottom 0.813: POWER_ON.2 11.12,2.78 JP1.1 | 25.01,4.03 26.49,4.03 JP2.1 | v15.16,10.43 15.16,11.33 R12.2